# Altium project BMS_V2.1_Adv.PrjPcb (part 3 of 3)

## Sheet Power Section.SchDoc
size A3; SheetNumber: 6; SheetTotal: 12
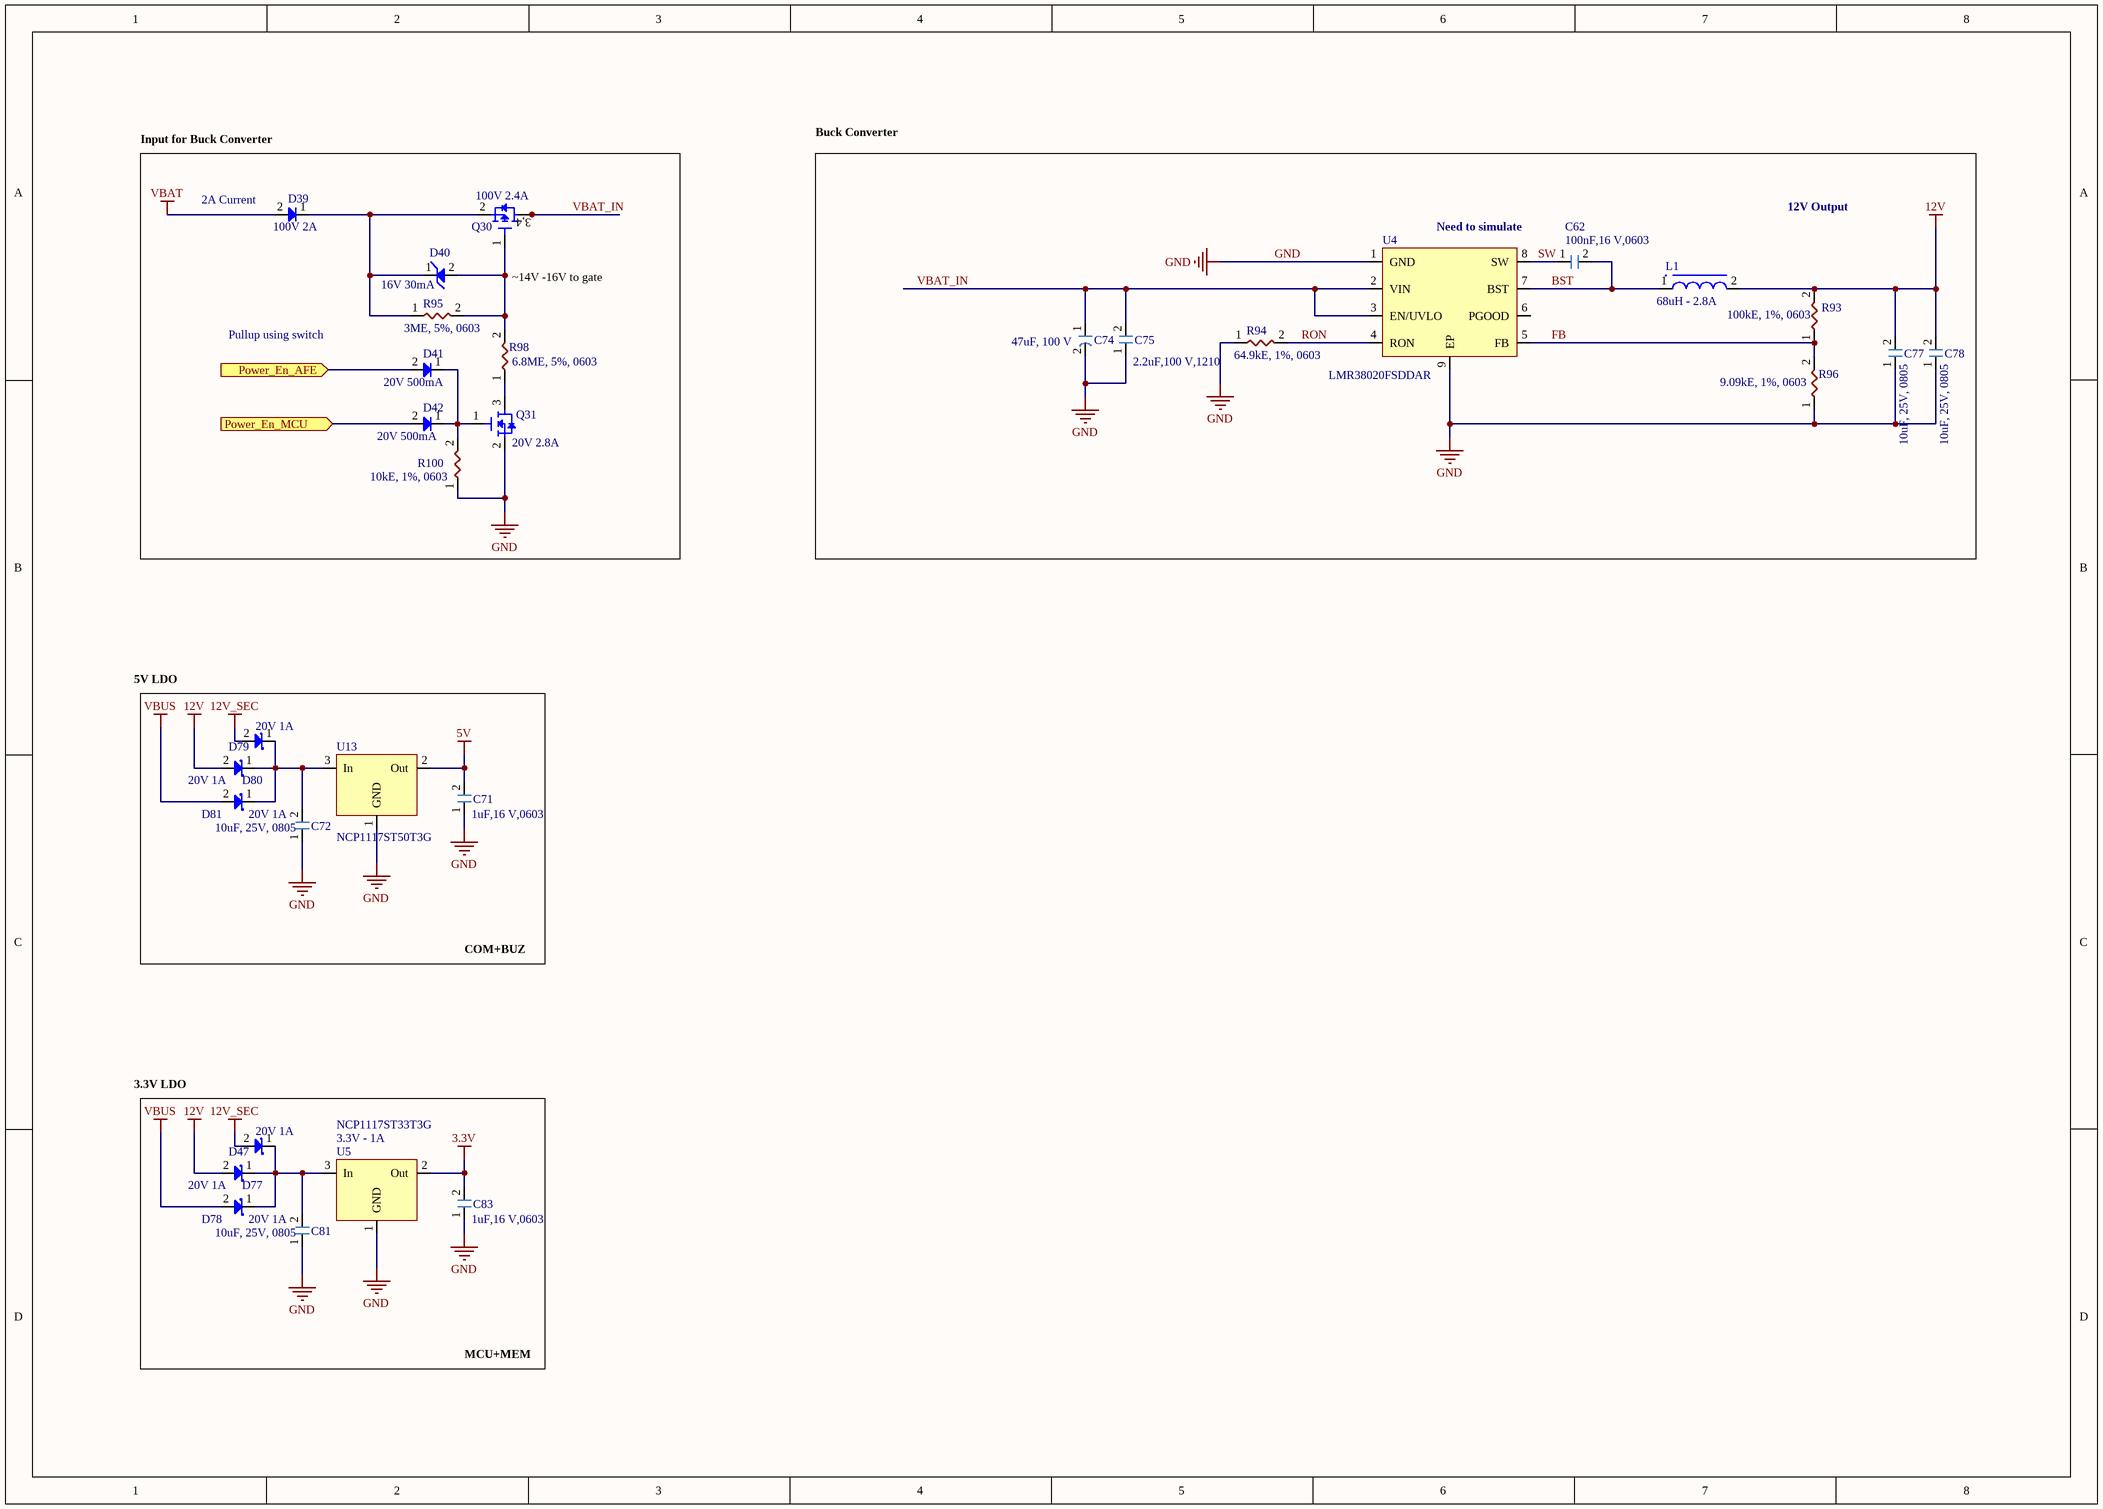
[diagram p7: Power Section.SchDoc]

### Parts
C62  Value Display: 100nF,16 V,0603  [CAPC1608X05N 0603]  (hidden comment: CC0603KRX7R7BB104)
C71  Value Display: 1uF,16 V,0603  [CAPC1608X05N 0603]  (hidden comment: CGA3E1X7R1C105K080AC)
C72  Value Display: 10uF, 25V, 0805  [CAPC2012X13N 0805]  (hidden comment: GRM21BZ71E106KE15L)
C74  Value Display: 47uF, 100 V  [Aluminium Electrolytic Capacitor]  (hidden comment: ESW476M100AH2AA)
C75  Value Display: 2.2uF,100 V,1210  [CAPC3225X28N 1210]  (hidden comment: HMK325B7225KMHT)
C77  Value Display: 10uF, 25V, 0805  [CAPC2012X13N 0805]  (hidden comment: GRM21BZ71E106KE15L)
C78  Value Display: 10uF, 25V, 0805  [CAPC2012X13N 0805]  (hidden comment: GRM21BZ71E106KE15L)
C81  Value Display: 10uF, 25V, 0805  [CAPC2012X13N 0805]  (hidden comment: GRM21BZ71E106KE15L)
C83  Value Display: 1uF,16 V,0603  [CAPC1608X05N 0603]  (hidden comment: CGA3E1X7R1C105K080AC)
D39  Value Display: 100V 2A  [SODFL350X110-2N]  (hidden comment: STPS2H100ZFY)
D40  Value Display: 16V 30mA  [DIODE_SOD123]  (hidden comment: MMSZ5246BQ-7-F)
D41  Value Display: 20V 500mA  [DIODE_SOD123]  (hidden comment: SBR80520LT1G)
D42  Value Display: 20V 500mA  [DIODE_SOD123]  (hidden comment: SBR80520LT1G)
D47  Value Display: 20V 1A  [SODFL360X98-2N]  (hidden comment: MBR120LSFT3G)
D77  Value Display: 20V 1A  [SODFL360X98-2N]  (hidden comment: MBR120LSFT3G)
D78  Value Display: 20V 1A  [SODFL360X98-2N]  (hidden comment: MBR120LSFT3G)
D79  Value Display: 20V 1A  [SODFL360X98-2N]  (hidden comment: MBR120LSFT3G)
D80  Value Display: 20V 1A  [SODFL360X98-2N]  (hidden comment: MBR120LSFT3G)
D81  Value Display: 20V 1A  [SODFL360X98-2N]  (hidden comment: MBR120LSFT3G)
L1  Value Display: 68uH - 2.8A  [INDP120120X102N]  (hidden comment: MSS1210-683ME)
Q30  Value Display: 100V 2.4A  [SOT230P700X180-4N]  (hidden comment: ZXMP10A17GQTA)
Q31  Value Display: 20V 2.8A  [SOT95P255X140-3N]  (hidden comment: DMG2302UK-7)
R93  Value Display: 100kE, 1%, 0603  [RESC1608X05N 0603]  (hidden comment: CRCW0805100KFKEA)
R94  Value Display: 64.9kE, 1%, 0603  [RESC1608X05N 0603]  (hidden comment: AC0603FR-0764K9L)
R95  Value Display: 3ME, 5%, 0603  [RESC1608X05N 0603]  (hidden comment: CRCW06033M00JNEA)
R96  Value Display: 9.09kE, 1%, 0603  [RESC1608X05N 0603]  (hidden comment: AC0603FR-079K09L)
R98  Value Display: 6.8ME, 5%, 0603  [RESC1608X05N 0603]  (hidden comment: CRCW06036M80JNEA)
R100  Value Display: 10kE, 1%, 0603  [RESC1608X05N 0603]  (hidden comment: CRCW060310K0FKEA)
U4  LMR38020FSDDAR  [SOIC127P600X170_HS-9N LM5164]
U5  NCP1117ST33T3G  Value Display: 3.3V - 1A  [SOT230P700X180-4N - NCP]
U13  NCP1117ST50T3G  [SOT230P700X180-4N - NCP]

### Blocks framed on the sheet
COM+BUZ: C71 C72 D79-D81 U13
MCU+MEM: C81 C83 D47 D77 D78 U5

### Ports
Power_En_AFE (in), Power_En_MCU (in)

### Nets
3.3V: C83.2 U5.2(Out)
5V: C71.2 U13.2(Out)
12V: C77.2 C78.2 D77.2(Anode) D80.2(Anode) L1.2 R93.2
12V_SEC: D47.2(Anode) D79.2(Anode)
GND: C71.1 C72.1 C74.2 C75.1 C77.1 C78.1 C81.1 C83.1 Q31.2(Source) R94.1 R96.1 R100.1 U4.1(GND) U4.9(EP) U5.1(GND) U13.1(GND)
VBAT: D39.2(Anode)
VBUS: D78.2(Anode) D81.2(Anode)
BST: C62.2 L1.1 U4.7(BST)
FB: R93.1 R96.2 U4.5(FB)
Power_En_AFE: D41.2(Anode) ; port Power_En_AFE
Power_En_MCU: D42.2(Anode) ; port Power_En_MCU
RON: R94.2 U4.4(RON)
SW: C62.1 U4.8(SW)
VBAT_IN: C74.1 C75.2 Q30.3(Drain) Q30.4(Drain) U4.2(VIN) U4.3(EN/UVLO)
NetC72_2: C72.2 D79.1(Cathode) D80.1(Cathode) D81.1(Cathode) U13.3(In)
NetC81_2: C81.2 D47.1(Cathode) D77.1(Cathode) D78.1(Cathode) U5.3(In)
NetD39_1: D39.1(Cathode) D40.1(Cathode) Q30.2(Source) R95.1
NetD40_2: D40.2(Anode) Q30.1(Gate) R95.2 R98.2
NetD41_1: D41.1(Cathode) D42.1(Cathode) Q31.1(Gate) R100.2
NetQ31_3: Q31.3(Drain) R98.1

Not connected (* = marked no-connect by the designer): U4 6(PGOOD)

### Notes on the sheet
- Input for Buck Converter
- Buck Converter
- (near D39) 2A Current
- (near U4) Need to simulate
- 12V Output
- (near Q30) ~14V -16V to gate
- Pullup using switch
- 5V LDO
- 3.3V LDO
- (in symbol FET_ZXMP10A17GQTA) 3,4

### Library data of the parts
C62 = Cap_CC0603KRX7R7BB104: Multilayer Ceramic Capacitor, 100 nF, 16V, ±10%,  X7R 0603 [1608 Metric]; Manufacturer: Yageo; Value: 100nF; Max Temp: 125 degC; Min Temp: -55 degC; Polarized: No; AEC-Q: NA; Manufacturer Part Number: CC0603KRX7R7BB104; Category: Capacitor; ComponentLink1Description: Datasheet; Mount Type: Surface Mount; Package: 0603; RoHS: Yes; Supplier 1: Digikey; Supplier 1 Part Number: 311-1088-1-ND; Supplier 1 pricing per Unit: 8.34 INR; Supplier: Mouser; Supplier Part Number: 603-CC603KRX7R7BB104; Supplier pricing per Unit: 8.34 INR; Technology: Ceramic; Temp Coefficient: X7R; Tolerance: 10%; Value 1: CC0603KRX7R7BB104; Voltage: 16V; ComponentLink1URL: https://www.yageo.com/upload/media/product/productsearch/datasheet/mlcc/UPY-GPHC_X7R_6.3V-to-250V_24.pdf
C71 C83 = Cap_CGA3E1X7R1C105K080AC: Multilayer Ceramic Capacitor, 1uF, 16V, ±10%,  X7R 0603 [1608 Metric]; Manufacturer: TDK Corporation; Polarized: No; AEC-Q: 200; Min Temp: -55 degC; Max Temp: 125 degC; Value: 1 uF; Manufacturer Part Number: CGA3E1X7R1C105K080AC; Package: 0603; RoHS: Yes; Mount Type: Surface Mount; Supplier 1: Digikey; Voltage: 16V; Tolerance: 10%; Technology: Ceramic; Value 1: CGA3E1X7R1C105K080AC; Category: Capacitor; ComponentLink1Description: Datasheet; ComponentLink1URL: https://product.tdk.com/system/files/dam/doc/product/capacitor/ceramic/mlcc/catalog/mlcc_automotive_general_en.pdf; Supplier 1 Part Number: 445-12539-1-ND; Supplier 1 pricing per Unit: 10.84 INR; Supplier: Mouser; Supplier Part Number: 810-CGA3E1X7R1C105AC; Supplier pricing per Unit: 10.01 INR; Temp Coefficient: X7R
C72 C77 C78 C81 = Cap_GRM21BZ71E106KE15L: Multilayer Ceramic Capacitor, 10 uF, 25V, ±10%,  X7R 0805 (2012 Metric); Manufacturer: Murata; AEC-Q: NA; Max Temp: 125 degC; Min Temp: -55 degC; Polarized: No; Value: 10 uF; Category: Capacitor; ComponentLink1Description: Datasheet; ComponentLink1URL: https://search.murata.co.jp/Ceramy/image/img/A01X/G101/ENG/GRM21BZ71E106KE15-01.pdf; Manufacturer Part Number: GRM21BZ71E106KE15L; Mount Type: Surface Mount; Package: 0805; RoHS: Yes; Supplier 1: Digikey; Supplier 1 Part Number: 490-GRM21BZ71E106KE15LCT-ND; Supplier 1 pricing per Unit: 28.51 INR; Supplier: Mouser; Supplier Part Number: 81-GRM21BZ71E106KE5L; Supplier pricing per Unit: 30.02 INR; Technology: Ceramic; Temp Coefficient: X7R; Tolerance: 10%; Value 1: GRM21BZ71E106KE15L; Voltage: 25V
C74 = Cap_ESW476M100AH2AA: Aluminum Electrolytic Capacitors Radial, 47 µF 100 V, Can 370mOhm @ 100kHz 5000 Hrs @ 105°C; Manufacturer: KEMET; AEC-Q: NA; Max Temp: 105 degC; Min Temp: -40 degC; Pitch: 5 mm; Polarized: Yes; Temp Coefficient: Electrolyte; Tolerance: 20%; Value: 47uF; Voltage: 100V; Manufacturer Part Number: ESW476M100AH2AA; Category: Capacitor; ComponentLink1Description: Datasheet; ComponentLink1URL: https://www.mouser.in/datasheet/2/447/KEM_A4009_ESW-3316312.pdf; Mount Type: TH; Package: TH; RoHS: Yes; Supplier 1: Digikey; Supplier 1 Part Number: 399-6631-ND; Supplier 1 pricing per Unit: 35.85 INR; Supplier: Mouser; Supplier Part Number: 80-ESW476M100AH2AA; Supplier pricing per Unit: 35.86 INR; Technology: Electrolyte; Value 1: ESW476M100AH2AA
C75 = Cap_HMK325B7225KMHT: Multilayer Ceramic Capacitor, 2.2 uF, 100 V, ± 10%, X7R, 1210 [3225 Metric]; Manufacturer: Taiyo Yuden; AEC-Q: 200; Max Temp: 125 degC; Min Temp: -55 degC; Polarized: No; Value: 2.2uF; Voltage: 100V; Manufacturer Part Number: HMK325B7225KMHT; Category: Capacitor; ComponentLink1Description: Datasheet; ComponentLink1URL: https://ds.yuden.co.jp/TYCOMPAS/ut/detail?pn=HMK325B7225KMHT%20%20&u=M; Mount Type: Surface Mount; Package: 1210; RoHS: Yes; Supplier 1: Digikey; Supplier 1 Part Number: 587-6142-1-ND; Supplier 1 pricing per Unit: 33.35 INR; Supplier: Mouser; Supplier Part Number: 963-HMK325B7225KMHT; Supplier pricing per Unit: 32.53 INR; Technology: Ceramic; Temp Coefficient: X7R; Tolerance: 10%; Value 1: HMK325B7225KMHT
D39 = Diode_STPS2H100ZFY: Diode 100 V 2A Surface Mount SOD-123F; Manufacturer: ST; AEC-Q: 101; Forward Voltage: 0.7V @ 2A; Max Temp: 175 degC; Min Temp: -40 degC; Value: 100V 2A; Voltage: 100V; Category: Diode; ComponentLink1Description: Datasheet; ComponentLink1URL: https://www.st.com/content/ccc/resource/technical/document/datasheet/group3/ee/fd/cc/9a/a8/bc/46/dd/DM00306086/files/DM00306086.pdf/jcr:content/translations/en.DM00306086.pdf; Forward Current: 2A; Manufacturer Part Number: STPS2H100ZFY; Mount Type: Surface Mount; Package: SOD 123; RoHS: Yes; Supplier 1: Digikey; Supplier 1 Part Number: 497-17158-1-ND; Supplier 1 pricing per Unit: 36.72 INR; Supplier: Mouser; Supplier Part Number: 511-STPS2H100ZFY; Supplier pricing per Unit: 36.70 INR; Value 1: STPS2H100ZFY
D40 = Diode_MMSZ5246BQ-7-F: Zener Diode 16 V 500 mW ±5% Surface Mount SOD-123; Manufacturer: Diodes Inc.; AEC-Q: 101; Forward Current: 30mA; Forward Voltage: 900 mV @ 10 mA; Max Temp: 150 degC; Min Temp: -65 degC; Power: 370mW; Value: 16V 30mA; Voltage: 16V; Category: Diode; ComponentLink1Description: Datasheet; ComponentLink1URL: https://www.diodes.com/assets/Datasheets/ds18010.pdf; Manufacturer Part Number: MMSZ5246BQ-7-F; Mount Type: Surface Mount; Package: SOD 123; RoHS: Yes; Supplier 1: Digikey; Supplier 1 Part Number: 31-MMSZ5246BQ-7-FTR-ND; Supplier: Mouser; Value 1: MMSZ5246BQ-7-F; Supplier 1 pricing per Unit: 17.9 INR; Supplier Part Number: 621-MMSZ5246BQ-7-F; Supplier pricing per Unit: 17.71 INR
D41 D42 = Diode_SBR80520LT1G: Diode 20 V 500mA Surface Mount SOD-123; Manufacturer: OnSemi; AEC-Q: NA; Forward Voltage: 385 mV @ 500 mA; Max Temp: 125 degC; Min Temp: -65 degC; Voltage: 20V; Category: Diode; ComponentLink1Description: Datasheet; ComponentLink1URL: https://www.onsemi.com/pdf/datasheet/mbr0520lt1-d.pdf; Forward Current: 500mA; Manufacturer Part Number: SBR80520LT1G; Mount Type: Surface Mount; Package: SOD 123; RoHS: Yes; Supplier 1: Digikey; Supplier 1 Part Number: SBR80520LT1GOSCT-ND; Supplier 1 pricing per Unit: 34.22 INR; Supplier: Mouser; Supplier Part Number: 863-SBR80520LT1G; Supplier pricing per Unit: 34.19 INR; Value 1: SBR80520LT1G; Value: 20V 500mA
D47 D77-D81 = Diode_MBR120LSFT3G: DIODE SCHOTTKY 20V 1A SOD123FL; Manufacturer: OnSemi; AEC-Q: NA; Forward Voltage: 450mV @ 1A; Max Temp: 125 degC; Min Temp: -55 degC; Value: 20V 1A; Category: Diode; ComponentLink1Description: Datasheet; ComponentLink1URL: https://www.onsemi.com/pdf/datasheet/mbr120lsft1-d.pdf; Forward Current: 1A; Manufacturer Part Number: MBR120LSFT3G; Mount Type: Surface Mount; Package: SOD 123; RoHS: Yes; Supplier 1: Digikey; Supplier 1 Part Number: MBR120LSFT3GOSCT-ND; Supplier 1 pricing per Unit: 27.69 INR; Supplier: Mouser; Supplier Part Number: 863-MBR120LSFT3G; Supplier pricing per Unit: 38.36 INR; Value 1: MBR120LSFT3G; Voltage: 20V
L1 = Ind_MSS1210-683ME: 68 µH Shielded Drum Core, Wirewound Inductor 2.8 A 80mOhm Max Nonstandard; Manufacturer: Coilcraft; Manufacturer Part Number: MSS1210-683MED; AEC-Q: 200; Max Temp: 85 degC; Min Temp: -40 degC; Value: 68uH - 2.8A; Category: Inductor; ComponentLink1Description: Datasheet; ComponentLink1URL: https://www.coilcraft.com/getmedia/f1a1bc5f-bdff-42f8-9ca8-1a0fb1d5094f/MSS1210.pdf; Mount Type: Surface Mount; Package: SMT; RoHS: Yes; Supplier 1: Digikey; Supplier 1 Part Number: 2457-MSS1210-683MED-ND; Supplier 1 pricing per Unit: 334.68 INR; Supplier: Mouser; Supplier Part Number: 994-MSS1210-683MED; Supplier pricing per Unit: 338.36 INR; Value 1: MSS1210-683MED
Q30 = FET_ZXMP10A17GQTA: P-Channel 100 V 2.4A (Ta) 2W (Ta) Surface Mount SOT-223-3; Manufacturer: Diodes Inc.; AEC-Q: 101; Forward Voltage: 100V; Max Temp: 150 degC; Min Temp: -55 degC; Rds ON: 350mΩ @ 2.4A @ -10V; Category: MOSFET; ComponentLink1Description: Datasheet; ComponentLink1URL: https://www.diodes.com/assets/Datasheets/ZXMP10A17GQ.pdf; Forward Current: 2.4A; Manufacturer Part Number: ZXMP10A17GQTA; Mount Type: Surface Mount; Package: SOT 23-3; Power: 2W; RoHS: Yes; Supplier 1: Digikey; Supplier 1 Part Number: ZXMP10A17GQTADICT-ND; Supplier 1 pricing per Unit: 85.13 INR; Supplier: Mouser; Supplier Part Number: 621-ZXMP10A17GQTA; Supplier pricing per Unit: 85.07 INR; Value 1: ZXMP10A17GQTA; Value: 100V 2.4A; Voltage: 100V; Channel: P-Channel
Q31 = FET_DMG2302UK-7: N-Channel 20 V 2.8A (Ta) 660mW (Ta) Surface Mount SOT-23-3; Manufacturer: Diodes Inc.; AEC-Q: 101; Forward Voltage: 20V; Max Temp: 150 degC; Min Temp: -55 degC; Rds ON: 90mOhms @ 3.6A, 4.5V; Manufacturer Part Number: DMG2302UK-7; Value: 20V 2.8A; RoHS: Yes; Category: MOSFET; ComponentLink1Description: Datasheet; ComponentLink1URL: https://www.diodes.com/assets/Datasheets/DMG2302UK.pdf; Forward Current: 2.8A; Mount Type: Surface Mount; Package: SOT 23-3; Power: 660mW; Supplier 1: Digikey; Supplier 1 Part Number: DMG2302UK-7DICT-ND; Supplier 1 pricing per Unit: 28.35 INR; Supplier: Mouser; Supplier Part Number: 621-DMG2302UK-7; Supplier pricing per Unit: 22.52 INR; Value 1: DMG2302UK-7; Voltage: 20V; Channel: N-Channel
R93 = Res_CRCW0603100KFKEA: SMD Chip Resistor, 100k Ohm, ± 1%, 100 mW, 0603 [1608 Metric], Thick Film, General Purpose; Manufacturer: Vishay Dale; AEC-Q: 200; Max Temp: 155 degC; Min Temp: -55 degC; Power: 1/10W; Value: 100k R; Manufacturer Part Number: CRCW0603100KFKEA; Category: Resistor; ComponentLink1Description: Datasheet; ComponentLink1URL: https://www.vishay.com/docs/20035/dcrcwe3.pdf; Mount Type: Surface Mount; Package: 0603; RoHS: Yes; Supplier 1: Digikey; Supplier 1 Part Number: 541-100KCCT-ND; Supplier 1 pricing per Unit: 8.34 INR; Supplier: Mouser; Supplier Part Number: 71-CRCW0603-100K-E3; Supplier pricing per Unit: 8.34 INR; Tolerance: 1%; Value 1: CRCW0603100KFKEA
R94 = Res_AC0603FR-0764K9L: SMD Chip Resistor,64.9k Ohms ±1% 0.1W, 1/10W, 0603 (1608 Metric) Anti-Sulfur, Automotive AEC-Q200 Thick Film; Manufacturer: Yageo; AEC-Q: 200; Max Temp: 155 degC; Min Temp: -55 degC; Value: 64.9k R; Category: Resistor; ComponentLink1Description: Datasheet; ComponentLink1URL: https://www.yageo.com/upload/media/product/productsearch/datasheet/rchip/PYu-AC_51_RoHS_L_10.pdf; Manufacturer Part Number: AC0603FR-0764K9L; Mount Type: Surface Mount; Package: 0603; Power: 1/10W; RoHS: Yes; Supplier 1: Digikey; Supplier 1 Part Number: 13-AC0603FR-0764K9LCT-ND; Supplier 1 pricing per Unit: 8.34 INR; Supplier: Mouser; Supplier Part Number: 603-AC0603FR-0764K9L; Supplier pricing per Unit: 8.34 INR; Tolerance: 1%; Value 1: AC0603FR-0764K9L
R95 = Res_CRCW06033M00JNEA: SMD Chip Resistor,3 MOhms ±5%, 1/10W, 0603 (1608 Metric) Anti-Sulfur, Automotive AEC-Q200 Thick Film; Manufacturer: Vishay Dale; AEC-Q: 200; Max Temp: 155 degC; Min Temp: -55 degC; Value: 3M R; Category: Resistor; ComponentLink1Description: Datasheet; ComponentLink1URL: https://www.vishay.com/docs/20035/dcrcwe3.pdf; Manufacturer Part Number: CRCW06033M00JNEA; Mount Type: Surface Mount; Package: 0603; Power: 1/10W; RoHS: Yes; Supplier 1: Digikey; Supplier 1 Part Number: 541-CRCW06033M00JNEACT-ND; Supplier 1 pricing per Unit: 8.34 INR; Supplier: Mouser; Supplier Part Number: 71-CRCW0603J-3M-E3; Supplier pricing per Unit: 8.34 INR; Tolerance: 5%; Value 1: CRCW06033M00JNEA
R96 = Res_AC0603FR-079K09L: SMD Chip Resistor,9.09k Ohms ±1% 0.1W, 1/10W, 0603 (1608 Metric) Anti-Sulfur, Automotive AEC-Q200 Thick Film; Manufacturer: Yageo; AEC-Q: 200; Max Temp: 155 degC; Min Temp: -55 degC; Value: 9.09k R; Category: Resistor; ComponentLink1Description: Datasheet; ComponentLink1URL: https://www.yageo.com/upload/media/product/productsearch/datasheet/rchip/PYu-AC_51_RoHS_L_10.pdf; Manufacturer Part Number: AC0603FR-079K09L; Mount Type: Surface Mount; Package: 0603; Power: 1/10W; RoHS: Yes; Supplier 1: Digikey; Supplier 1 Part Number: 13-AC0603FR-079K09LCT-ND; Supplier 1 pricing per Unit: 8.34 INR; Supplier: Mouser; Supplier Part Number: 603-AC0603FR-079K09L; Supplier pricing per Unit: 8.34 INR; Tolerance: 1%; Value 1: AC0603FR-079K09L
R98 = Res_CRCW06036M80JNEA: SMD Chip Resistor,6.8 MOhms ±5%, 1/10W, 0603 (1608 Metric) Anti-Sulfur, Automotive AEC-Q200 Thick Film; Manufacturer: Vishay Dale; AEC-Q: 200; Max Temp: 155 degC; Min Temp: -55 degC; Value: 6.8M R; Category: Resistor; ComponentLink1Description: Datasheet; ComponentLink1URL: https://www.vishay.com/docs/20035/dcrcwe3.pdf; Manufacturer Part Number: CRCW06036M80JNEA; Mount Type: Surface Mount; Package: 0603; Power: 1/10W; RoHS: Yes; Supplier 1: Digikey; Supplier 1 Part Number: 541-CRCW06036M80JNEACT-ND; Supplier 1 pricing per Unit: 8.34 INR; Supplier: Mouser; Supplier Part Number: 71-CRCW0603J-6.8M-E3; Supplier pricing per Unit: 8.34 INR; Tolerance: 5%; Value 1: CRCW06036M80JNEA
R100 = Res_CRCW060310K0FKEA: SMD Chip Resistor, 10 kOhm,±1%, 100 mW, 0603 [1608 Metric], Thick Film, General Purpose; Manufacturer: Vishay Dale; AEC-Q: 200; Max Temp: 155 degC; Min Temp: -55 degC; Power: 1/10W; Value: 10k R; Category: Resistor; ComponentLink1Description: Datasheet; ComponentLink1URL: https://www.vishay.com/docs/20035/dcrcwe3.pdf; Manufacturer Part Number: CRCW060310K0FKEA; Mount Type: Surface Mount; Package: 0603; RoHS: Yes; Supplier 1: Digikey; Supplier 1 Part Number: 541-10.0KHCT-ND; Supplier 1 pricing per Unit: 8.34 INR; Supplier: Mouser; Supplier Part Number: 71-CRCW0603-10K-E3; Supplier pricing per Unit: 8.34 INR; Tolerance: 1%; Value 1: CRCW060310K0FKEA
U4 = IC_LMR38020FSDDAR: Buck Switching Regulator IC Positive Adjustable 1V 1 Output 2A 8-PowerSOIC (0.154", 3.90mm Width); Manufacturer: Texas Instruments; AEC-Q: NA; Max Temp: 150 degC; Min Temp: -40 degC; Voltage: 4.5V - 80V; Category: Buck Converter IC; ComponentLink1Description: Datasheet; ComponentLink1URL: https://www.ti.com/lit/ds/symlink/lmr38020.pdf?ts=1730698175380&ref_url=https%253A%252F%252Fwww.ti.com%252Fproduct%252FLMR38020%253FkeyMatch%253DLMR38020%2526tisearch%253Duniversal_search; Manufacturer Part Number: LMR38020FSDDAR; Mount Type: Surface Mount; Package: DDA (SO Power PAD); RoHS: Yes; Supplier 1: Digikey; Supplier 1 Part Number: 296-LMR38020FSDDARCT-ND; Supplier 1 pricing per Unit: 207.70 INR; Supplier: Mouser; Supplier Part Number: 595-LMR38020FSDDAR; Supplier pricing per Unit: 206.00 INR; Value 1: LMR38020FSDDAR; Value: LMR38020FSDDAR; Value Display: LMR38020FSDDAR
U5 = IC_NCP1117ST33T3G: LDO Voltage Regulators 3.3V 1A Positive; Manufacturer: OnSemi; AEC-Q: NA; Max Temp: 125 degC; Min Temp: 0 degC; Value: 3.3V - 1A; Voltage: 20V (Max); Category: LDO; ComponentLink1Description: Datasheet; ComponentLink1URL: https://www.onsemi.com/pdf/datasheet/ncp1117-d.pdf; Manufacturer Part Number: NCP1117ST33T3G; Mount Type: Surface Mount; Package: SOT 22-3; RoHS: Yes; Supplier 1: Digikey; Supplier 1 Part Number: NCP1117ST33T3GOSCT-ND; Supplier 1 pricing per Unit: 93.9 INR; Supplier: Mouser; Supplier Part Number: 863-NCP1117ST33T3G; Supplier pricing per Unit: 56.71 INR; Value 1: NCP1117ST33T3G
U13 = IC_NCP1117ST50T3G: LDO Voltage Regulators 5V 1A Positive; Manufacturer: OnSemi; AEC-Q: NA; Max Temp: 125 degC; Min Temp: 0 degC; Value: 5V - 1A; Voltage: 20V (Max); Category: LDO; ComponentLink1Description: Datasheet; ComponentLink1URL: https://www.onsemi.com/pdf/datasheet/ncp1117-d.pdf; Manufacturer Part Number: NCP1117ST50T3G; Mount Type: Surface Mount; Package: SOT 22-3; RoHS: Yes; Supplier 1: Digikey; Supplier 1 Part Number: NCP1117ST50T3GOSCT-ND; Supplier 1 pricing per Unit: 94.18 INR; Supplier: Mouser; Supplier Part Number: 863-NCP1117ST50T3G; Supplier pricing per Unit: 56.71 INR; Value 1: NCP1117ST50T3G; Value Display: 5V - 1A

## Sheet Accelerometer.SchDoc
size A3; SheetNumber: 10; SheetTotal: 12
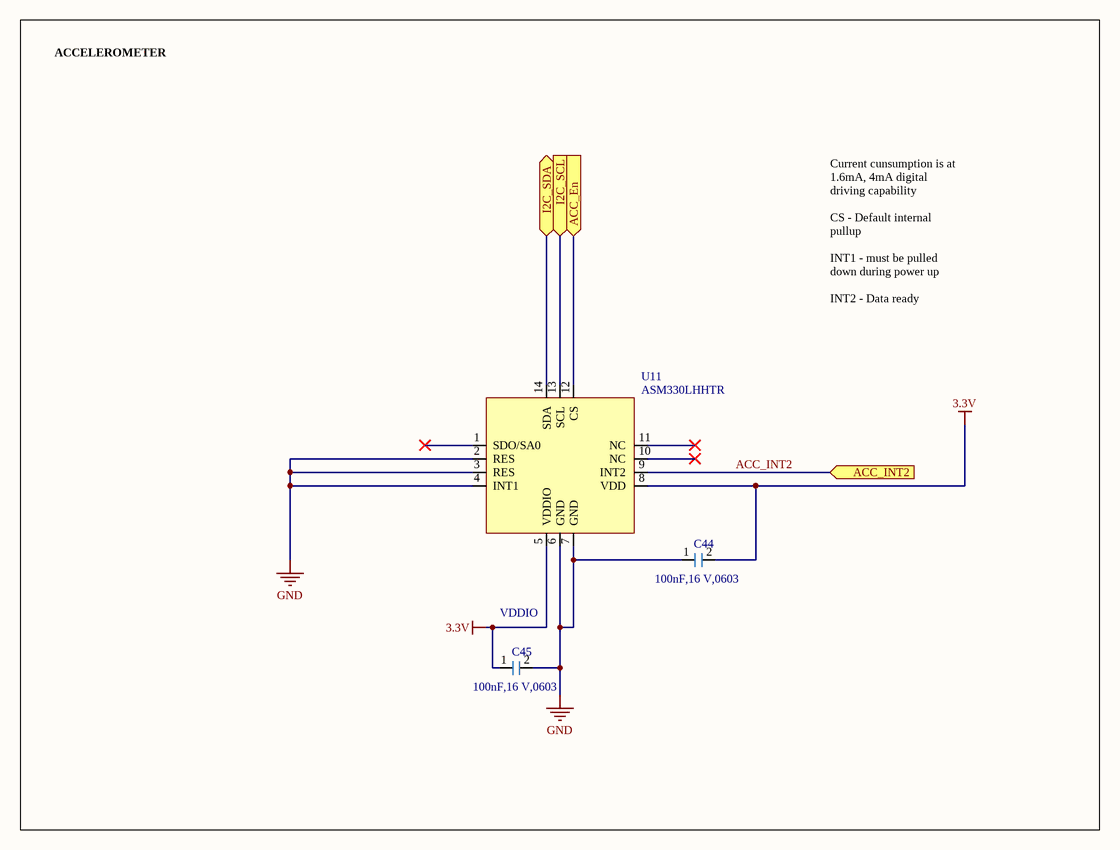
[diagram p8: Accelerometer.SchDoc]

### Parts
C44  Value Display: 100nF,16 V,0603  [CAPC1608X05N 0603]  (hidden comment: CC0603KRX7R7BB104)
C45  Value Display: 100nF,16 V,0603  [CAPC1608X05N 0603]  (hidden comment: CC0603KRX7R7BB104)
U11  ASM330LHHTR  [QFN50P300X250X86-14N_ASM330LHHTR]

### Ports
ACC_En (in), ACC_INT2 (in), I2C_SCL (in), I2C_SDA (bidir)

### Nets
3.3V: C44.2 C45.1 U11.5(VDDIO) U11.8(VDD)
GND: C44.1 C45.2 U11.2(RES) U11.3(RES) U11.4(INT1) U11.6(GND) U11.7(GND)
ACC_INT2: U11.9(INT2) ; port ACC_INT2
I2C_EN: U11.12(CS) ; port ACC_En
I2C_SCL: U11.13(SCL) ; port I2C_SCL
I2C_SDA: U11.14(SDA) ; port I2C_SDA

Not connected (* = marked no-connect by the designer): U11 1(SDO/SA0)* 10(NC)* 11(NC)*

### Notes on the sheet
- ACCELEROMETER
- Current cunsumption is at 1.6mA, 4mA digital driving capability
  CS - Default internal pullup
  INT1 - must be pulled down during power up
  INT2 - Data ready
- VDDIO

### Library data of the parts
C44 C45 = Cap_CC0603KRX7R7BB104: as C62 on sheet Power Section; Manufacturer Part Number: CC0603KRX7R7BB104; Category: Capacitor; ComponentLink1Description: Datasheet; Mount Type: Surface Mount; Package: 0603; RoHS: Yes; Supplier 1: Digikey; Supplier 1 Part Number: 311-1088-1-ND; Supplier 1 pricing per Unit: 8.34 INR; Supplier: Mouser; Supplier Part Number: 603-CC603KRX7R7BB104; Supplier pricing per Unit: 8.34 INR; Technology: Ceramic; Temp Coefficient: X7R; Tolerance: 10%; Value 1: CC0603KRX7R7BB104; Voltage: 16V; ComponentLink1URL: https://www.yageo.com/upload/media/product/productsearch/datasheet/mlcc/UPY-GPHC_X7R_6.3V-to-250V_24.pdf
U11 = IC_ASM330LHHTR: Accelerometer, Gyroscope, Temperature, 6 Axis Sensor I2C, SPI Output; Manufacturer: ST; AEC-Q: 100; Max Temp: 105 degC; Min Temp: -40 degC; Value: 6D IMU; Voltage: 3.3V; Category: Inertial module; ComponentLink1Description: Datasheet; ComponentLink1URL: https://www.st.com/resource/en/datasheet/asm330lhh.pdf; Manufacturer Part Number: ASM330LHHTR; Mount Type: Surface Mount; Package: SMT; RoHS: Yes; Supplier 1: Digikey; Supplier 1 Part Number: 497-19078-1-ND; Supplier 1 pricing per Unit: 850.9 INR; Supplier: Mouser; Supplier Part Number: 511-ASM330LHHTR; Supplier pricing per Unit: 810.11 INR; Value 1: ASM330LHHTR; Value Display: ASM330LHHTR

## Sheet Connections1.SchDoc
size A3; SheetNumber: 12; SheetTotal: 12
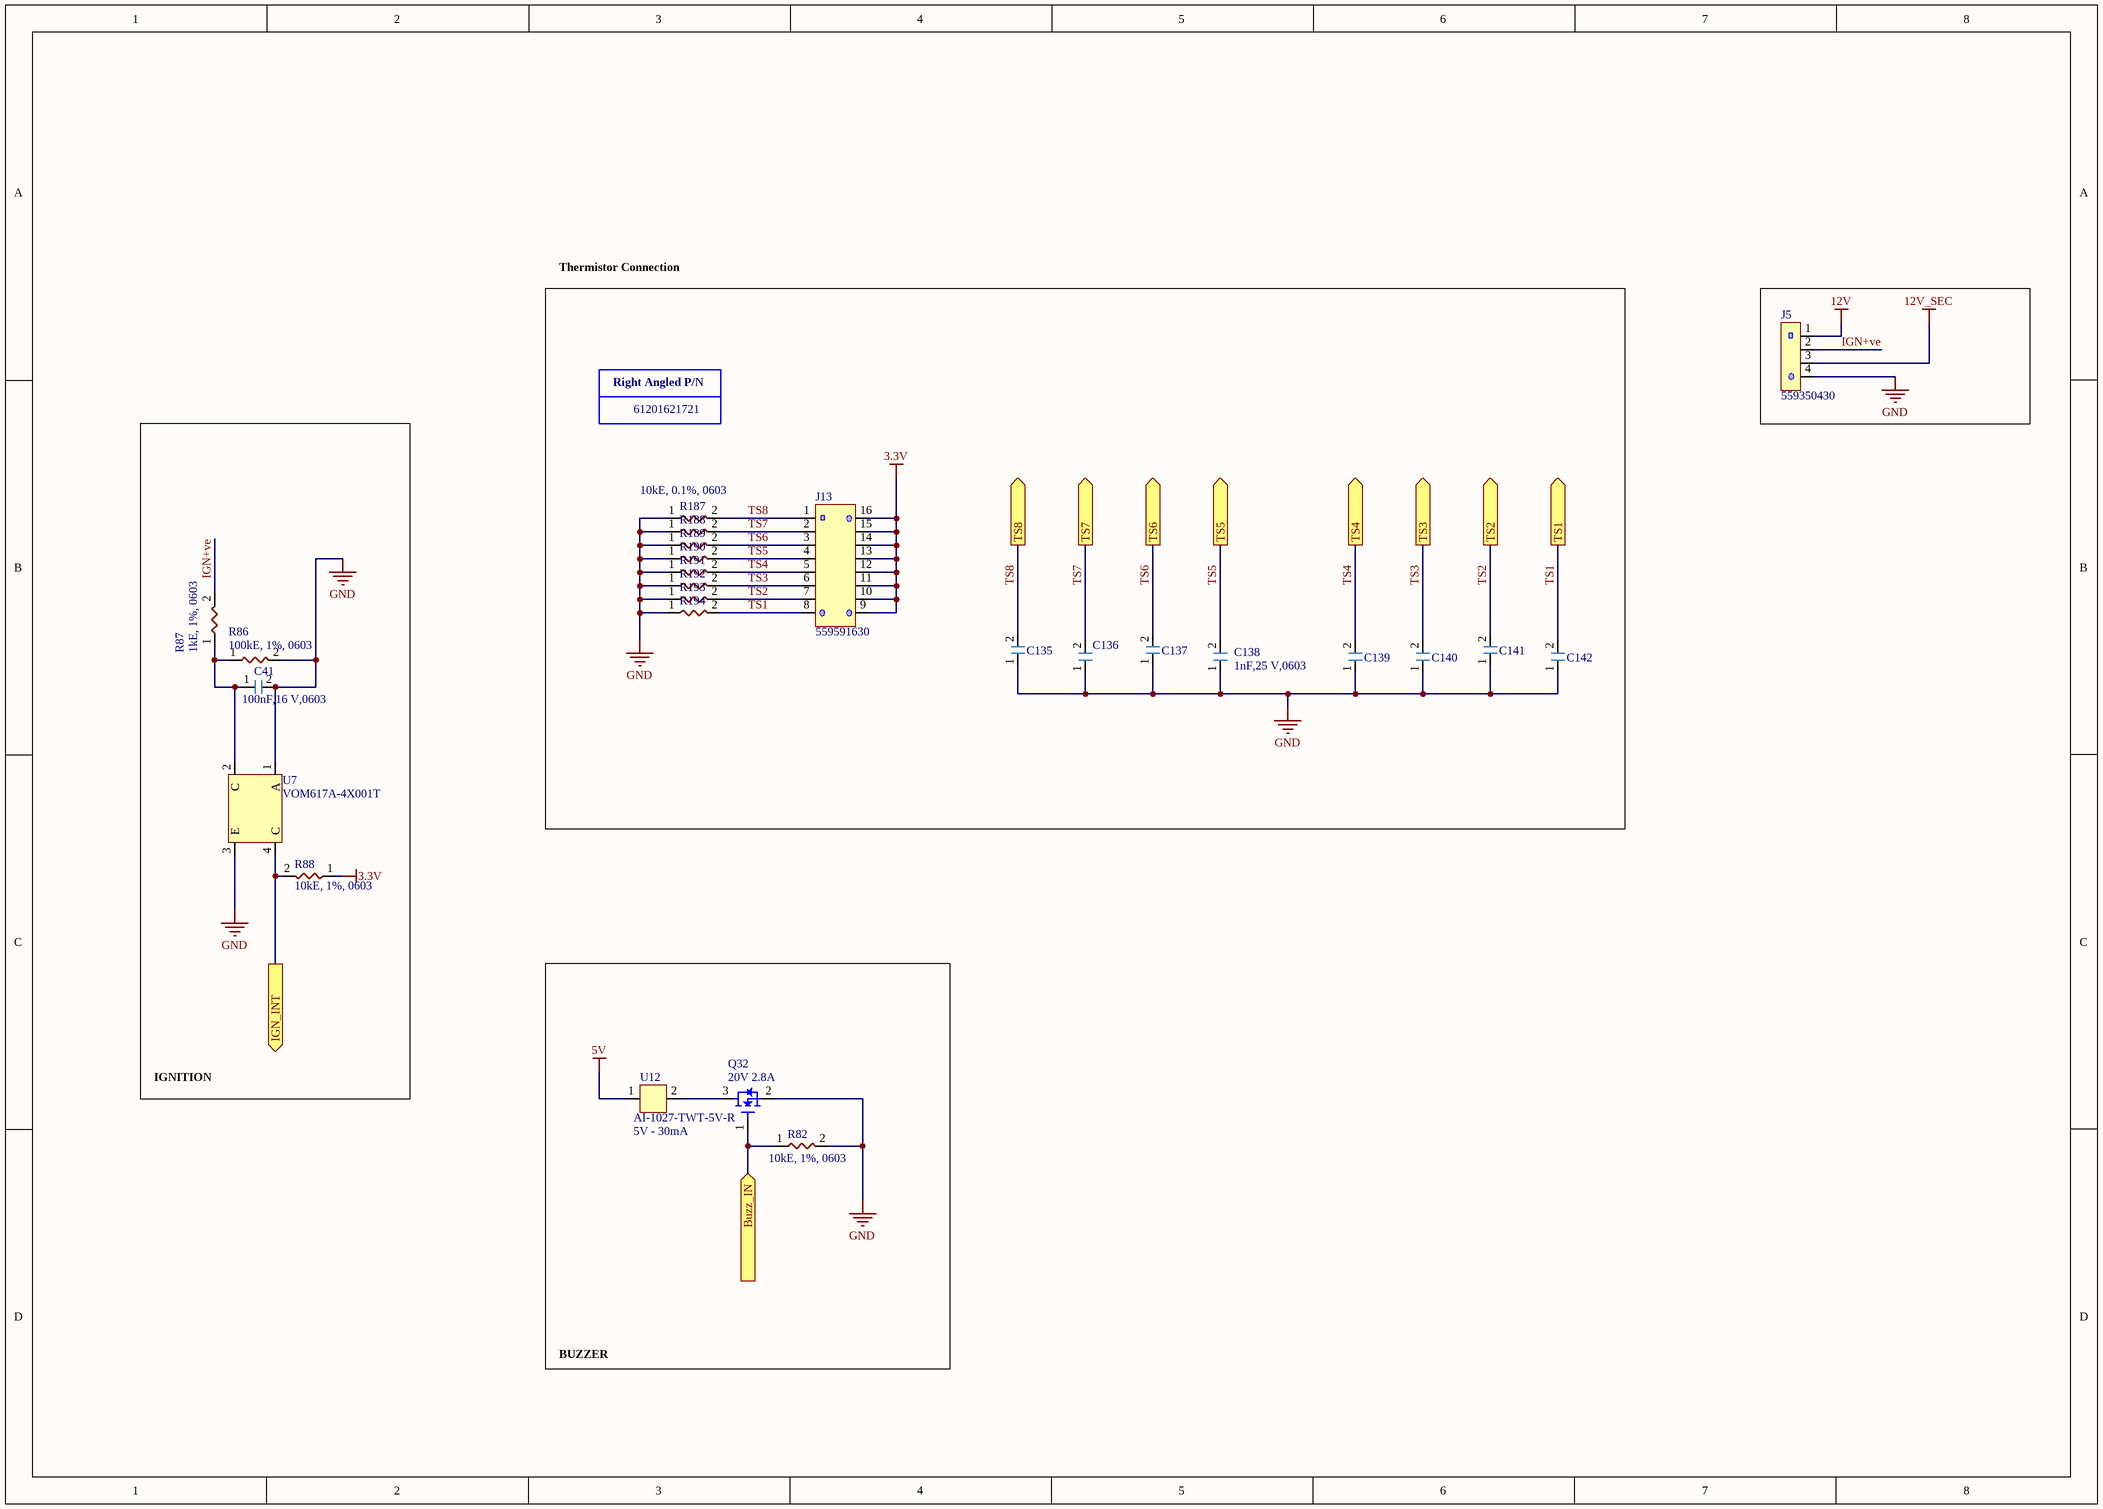
[diagram p9: Connections1.SchDoc]

### Parts
C41  Value Display: 100nF,16 V,0603  [CAPC1608X05N 0603]  (hidden comment: CC0603KRX7R7BB104)
C135  C0603C102J3GACAUTO  [CAPC1608X05N 0603]  (value not drawn)
C136  C0603C102J3GACAUTO  [CAPC1608X05N 0603]  (value not drawn)
C137  C0603C102J3GACAUTO  [CAPC1608X05N 0603]  (value not drawn)
C138  Value Display: 1nF,25 V,0603  [CAPC1608X05N 0603]  (hidden comment: C0603C102J3GACAUTO)
C139  C0603C102J3GACAUTO  [CAPC1608X05N 0603]  (value not drawn)
C140  C0603C102J3GACAUTO  [CAPC1608X05N 0603]  (value not drawn)
C141  C0603C102J3GACAUTO  [CAPC1608X05N 0603]  (value not drawn)
C142  C0603C102J3GACAUTO  [CAPC1608X05N 0603]  (value not drawn)
J5  559350430  [Con_559350430]
J13  559591630  [Con_0559591630]
Q32  Value Display: 20V 2.8A  [SOT95P255X140-3N]  (hidden comment: DMG2302UK-7)
R82  Value Display: 10kE, 1%, 0603  [RESC1608X05N 0603]  (hidden comment: CRCW060310K0FKEA)
R86  Value Display: 100kE, 1%, 0603  [RESC1608X05N 0603]  (hidden comment: CRCW0805100KFKEA)
R87  Value Display: 1kE, 1%, 0603  [RESC1608X05N 0603]  (hidden comment: AC0603FR-7W1KL)
R88  Value Display: 10kE, 1%, 0603  [RESC1608X05N 0603]  (hidden comment: CRCW060310K0FKEA)
R187  Value Display: 10kE, 0.1%, 0603  [RESC1608X05N 0603]  (hidden comment: RNCF0603BTE10K0)
R188  RNCF0603BTE10K0  [RESC1608X05N 0603]  (value not drawn)
R189  RNCF0603BTE10K0  [RESC1608X05N 0603]  (value not drawn)
R190  RNCF0603BTE10K0  [RESC1608X05N 0603]  (value not drawn)
R191  RNCF0603BTE10K0  [RESC1608X05N 0603]  (value not drawn)
R192  RNCF0603BTE10K0  [RESC1608X05N 0603]  (value not drawn)
R193  RNCF0603BTE10K0  [RESC1608X05N 0603]  (value not drawn)
R194  RNCF0603BTE10K0  [RESC1608X05N 0603]  (value not drawn)
U7  VOM617A-4X001T  [SOIC127P700X220-4N TLP293]
U12  AI-1027-TWT-5V-R  Value Display: 5V - 30mA  [Buzzer]

### Blocks framed on the sheet
IGNITION: C41 R86-R88 U7
BUZZER: Q32 R82 U12

### Ports
Buzz_IN (in), IGN_INT (out), TS1 (out), TS2 (out), TS3 (out), TS4 (out), TS5 (out), TS6 (out), TS7 (out), TS8 (out)

### Nets
3.3V: J13.9 J13.10 J13.11 J13.12 J13.13 J13.14 J13.15 J13.16 R88.1
5V: U12.1(+ve)
12V: J5.1
12V_SEC: J5.3
GND: C41.2 C135.1 C136.1 C137.1 C138.1 C139.1 C140.1 C141.1 C142.1 J5.4 Q32.2(Source) R82.2 R86.2 R187.1 R188.1 R189.1 R190.1 R191.1 R192.1 R193.1 R194.1 U7.1(A) U7.3(E)
BUZZ_IN: Q32.1(Gate) R82.1 ; port Buzz_IN
IGN+ve: J5.2 R87.2
IGN_INT: R88.2 U7.4(C) ; port IGN_INT
TS1: C142.2 J13.8 R194.2 ; port TS1
TS2: C141.2 J13.7 R193.2 ; port TS2
TS3: C140.2 J13.6 R192.2 ; port TS3
TS4: C139.2 J13.5 R191.2 ; port TS4
TS5: C138.2 J13.4 R190.2 ; port TS5
TS6: C137.2 J13.3 R189.2 ; port TS6
TS7: C136.2 J13.2 R188.2 ; port TS7
TS8: C135.2 J13.1 R187.2 ; port TS8
NetC41_1: C41.1 R86.1 R87.1 U7.2(C)
NetQ32_3: Q32.3(Drain) U12.2(-ve)

### Notes on the sheet
- Thermistor Connection
- Right Angled P/N
- 61201621721

### Library data of the parts
C41 = Cap_CC0603KRX7R7BB104: as C62 on sheet Power Section; Manufacturer Part Number: CC0603KRX7R7BB104; Category: Capacitor; ComponentLink1Description: Datasheet; Mount Type: Surface Mount; Package: 0603; RoHS: Yes; Supplier 1: Digikey; Supplier 1 Part Number: 311-1088-1-ND; Supplier 1 pricing per Unit: 8.34 INR; Supplier: Mouser; Supplier Part Number: 603-CC603KRX7R7BB104; Supplier pricing per Unit: 8.34 INR; Technology: Ceramic; Temp Coefficient: X7R; Tolerance: 10%; Value 1: CC0603KRX7R7BB104; Voltage: 16V; ComponentLink1URL: https://www.yageo.com/upload/media/product/productsearch/datasheet/mlcc/UPY-GPHC_X7R_6.3V-to-250V_24.pdf
C135-C137 C139-C142 = Cap_C0603C102J3GACAUTO: Multilayer Ceramic Capacitor, 1000 pF, 25V, ±5%,  C0G 0603 [1608 Metric]; Manufacturer: KEMET; Value: 1nF; Max Temp: 125 degC; Min Temp: -55 degC; Polarized: No; Temp Coefficient: C0G, NP0; Value Display: 1nF,25 V,0603; AEC-Q: 200; Manufacturer Part Number: C0603C102J3GACAUTO; Voltage: 25V; Category: Capacitor; ComponentLink1Description: Datasheet; Mount Type: Surface Mount; Package: 0603; RoHS: Yes; Supplier 1: Digikey; Supplier 1 Part Number: 399-C0603C102J3GACAUTOCT-ND; Supplier 1 pricing per Unit: 9.17 INR; Supplier: Mouser; Supplier Part Number: 80-C0603C102J3GAUTO; Supplier pricing per Unit: 8.34 INR; Technology: Ceramic; Tolerance: 5%; Value 1: C0603C102J3GACAUTO; ComponentLink1URL: https://connect.kemet.com:7667/gateway/IntelliData-ComponentDocumentation/1.0/download/datasheet/C0603C102J3GACAUTO
C138 = Cap_C0603C102J3GACAUTO: Multilayer Ceramic Capacitor, 1000 pF, 25V, ±5%,  C0G 0603 [1608 Metric]; Manufacturer: KEMET; Value: 1nF; Max Temp: 125 degC; Min Temp: -55 degC; Polarized: No; Temp Coefficient: C0G, NP0; AEC-Q: 200; Manufacturer Part Number: C0603C102J3GACAUTO; Voltage: 25V; Category: Capacitor; ComponentLink1Description: Datasheet; Mount Type: Surface Mount; Package: 0603; RoHS: Yes; Supplier 1: Digikey; Supplier 1 Part Number: 399-C0603C102J3GACAUTOCT-ND; Supplier 1 pricing per Unit: 9.17 INR; Supplier: Mouser; Supplier Part Number: 80-C0603C102J3GAUTO; Supplier pricing per Unit: 8.34 INR; Technology: Ceramic; Tolerance: 5%; Value 1: C0603C102J3GACAUTO; ComponentLink1URL: https://connect.kemet.com:7667/gateway/IntelliData-ComponentDocumentation/1.0/download/datasheet/C0603C102J3GACAUTO
J5 = Con_559350430: 2.00mm Pitch MicroClasp Wire-to-Board Header, Dual Row, Right Angle, 4 Circuits; Crimp Part Number: 561349000; Manufacturer: Molex; Manufacturer Part Number: 0559350430; Mating Part Number: 513820400; Circuits: 4; AEC-Q: NA; Rows: 1; Value: 4 Pin; Value Display: 4 Pin/RA/TH; Category: Connector; Colour: Natural; ComponentLink1Description: Datasheet; Pitch: 2.00 mm; ComponentLink1URL: https://www.molex.com/en-us/products/part-detail-pdf/559350430?display=pdf; Mount Type: TH; Package: THT; RoHS: Yes; Supplier 1: Digikey; Supplier 1 Part Number: WM12300-ND; Supplier 1 pricing per Unit: 36.05 INR; Supplier: Mouser; Supplier Part Number: 538-55935-0430; Supplier pricing per Unit: 28.36 INR; Value 1: 559350430
J13 = Con_559591630: 2.00mm Pitch MicroClasp Wire-to-Board Header, Dual Row, Right Angle, 16 Circuits; Crimp Part Number: 561349000; Manufacturer: Molex; Manufacturer Part Number: 0559591630; Mating Part Number: 513531600; AEC-Q: No; Circuits: 16; Pitch (mm): 2.00; Rows: 2; Value: 0559591630; Category: Connector; Colour: Natural; RoHS: Yes; Supplier 1: Digikey; Supplier 1 Part Number: WM7597-ND; Supplier 1 Price per Unit: 77.84; Supplier: Mouser; Supplier Part Number: 538-55959-1630; Supplier Price per Unit: 74.23
Q32 = FET_DMG2302UK-7: as Q31 on sheet Power Section; Manufacturer Part Number: DMG2302UK-7; Value: 20V 2.8A; RoHS: Yes; Category: MOSFET; ComponentLink1Description: Datasheet; ComponentLink1URL: https://www.diodes.com/assets/Datasheets/DMG2302UK.pdf; Forward Current: 2.8A; Mount Type: Surface Mount; Package: SOT 23-3; Power: 660mW; Supplier 1: Digikey; Supplier 1 Part Number: DMG2302UK-7DICT-ND; Supplier 1 pricing per Unit: 28.35 INR; Supplier: Mouser; Supplier Part Number: 621-DMG2302UK-7; Supplier pricing per Unit: 22.52 INR; Value 1: DMG2302UK-7; Voltage: 20V; Channel: N-Channel
R82 R88 = Res_CRCW060310K0FKEA: as R100 on sheet Power Section; Category: Resistor; ComponentLink1Description: Datasheet; ComponentLink1URL: https://www.vishay.com/docs/20035/dcrcwe3.pdf; Manufacturer Part Number: CRCW060310K0FKEA; Mount Type: Surface Mount; Package: 0603; RoHS: Yes; Supplier 1: Digikey; Supplier 1 Part Number: 541-10.0KHCT-ND; Supplier 1 pricing per Unit: 8.34 INR; Supplier: Mouser; Supplier Part Number: 71-CRCW0603-10K-E3; Supplier pricing per Unit: 8.34 INR; Tolerance: 1%; Value 1: CRCW060310K0FKEA
R86 = Res_CRCW0603100KFKEA: as R93 on sheet Power Section; Manufacturer Part Number: CRCW0603100KFKEA; Category: Resistor; ComponentLink1Description: Datasheet; ComponentLink1URL: https://www.vishay.com/docs/20035/dcrcwe3.pdf; Mount Type: Surface Mount; Package: 0603; RoHS: Yes; Supplier 1: Digikey; Supplier 1 Part Number: 541-100KCCT-ND; Supplier 1 pricing per Unit: 8.34 INR; Supplier: Mouser; Supplier Part Number: 71-CRCW0603-100K-E3; Supplier pricing per Unit: 8.34 INR; Tolerance: 1%; Value 1: CRCW0603100KFKEA
R87 = Res_AC0603FR-7W1KL: SMD Chip Resistor, 1k Ohms ±1% , 1/5W, 0603 (1608 Metric) Anti-Sulfur, Automotive AEC-Q200 Thick Film; Manufacturer: Yageo; AEC-Q: 200; Max Temp: 155 degC; Min Temp: -55 degC; Value: 1k R; Category: Resistor; ComponentLink1Description: Datasheet; ComponentLink1URL: https://www.yageo.com/upload/media/product/productsearch/datasheet/rchip/PYu-AC_51_RoHS_L_10.pdf; Manufacturer Part Number: AC0603FR-7W1KL; Mount Type: Surface Mount; Package: 0603; Power: 1/5 W; RoHS: Yes; Supplier 1: Digikey; Supplier 1 Part Number: 13-AC0603FR-7W1KLCT-ND; Supplier 1 pricing per Unit: 8.34 INR; Supplier: Mouser; Supplier Part Number: 603-AC0603FR-7W1KL; Supplier pricing per Unit: 8.34 INR; Tolerance: 1%; Value 1: AC0603FR-7W1KL
R187 = Res_RNCF0603BTE10K0: SMD Chip Resistor, 10 kOhm, 100 mW, 0603 [1608 Metric], Thick Film, General Purpose, High Precision; Manufacturer: Stackpole Electronics; Value: 10k R; Tolerance: 0.1%; AEC-Q: 200; Max Temp: 155 degC; Min Temp: -55 degC; Power: 1/6W; Manufacturer Part Number: RNCF0603BTE10K0; Package: 0603; Category: Resistor; ComponentLink1Description: Datasheet; ComponentLink1URL: https://www.seielect.com/catalog/sei-rncf.pdf; Mount Type: Surface Mount; RoHS: Yes; Supplier 1: Digikey; Supplier 1 Part Number: RNCF0603BTE10K0CT-ND; Supplier 1 pricing per Unit: 13.34 INR; Supplier: Mouser; Supplier Part Number: 708-RNCF0603BTE10K0; Supplier pricing per Unit: 12.51 INR; Value 1: RNCF0603BTE10K0
R188-R194 = Res_RNCF0603BTE10K0: SMD Chip Resistor, 10 kOhm, 100 mW, 0603 [1608 Metric], Thick Film, General Purpose, High Precision; Manufacturer: Stackpole Electronics; Value: 10k R; Tolerance: 0.1%; AEC-Q: 200; Max Temp: 155 degC; Min Temp: -55 degC; Power: 1/6W; Value Display: 10kE, 0.1%, 0603; Manufacturer Part Number: RNCF0603BTE10K0; Package: 0603; Category: Resistor; ComponentLink1Description: Datasheet; ComponentLink1URL: https://www.seielect.com/catalog/sei-rncf.pdf; Mount Type: Surface Mount; RoHS: Yes; Supplier 1: Digikey; Supplier 1 Part Number: RNCF0603BTE10K0CT-ND; Supplier 1 pricing per Unit: 13.34 INR; Supplier: Mouser; Supplier Part Number: 708-RNCF0603BTE10K0; Supplier pricing per Unit: 12.51 INR; Value 1: RNCF0603BTE10K0
U7 = IC_VOM617A-4X001T: Optoisolator Transistor Output 3750Vrms 1 Channel 4-SOP; Manufacturer: Vishay Dale; AEC-Q: NA; Max Temp: 110 degC; Min Temp: -55 degC; Value: 1.6V - 60mA/ 80V - 100mA; Category: Opto Coupler; ComponentLink1Description: Datasheet; ComponentLink1URL: https://www.vishay.com/docs/83446/vom617a.pdf; Manufacturer Part Number: VOM617A-4X001T; Mount Type: Surface Mount; Package: SOP 4; RoHS: Yes; Supplier 1: Digikey; Supplier 1 Part Number: VOM617A-4X001TCT-ND; Supplier 1 pricing per Unit: 52.14 INR; Supplier: Mouser; Supplier Part Number: 78-VOM617A-4X001T; Supplier pricing per Unit: 52.71 INR; Value 1: VOM617A-4X001T; Value Display: 1.6V - 60mA/ 80V - 100mA; Voltage: 3750 VRMS
U12 = IC_AI-1027-TWT-5V-R: Buzzers Indicator, Internally Driven Electromechanical/Magnetic 5 V 30mA 2.7kHz 80dB @ 5V, 10cm Through Hole PC Pins; Manufacturer: PUIaudio; AEC-Q: NA; Max Temp: 80 degC; Min Temp: -20 degC; Category: Buzzer; ComponentLink1Description: Datasheet; ComponentLink1URL: https://docs.google.com/gview?url=https://api.puiaudio.com/filename/AI-1027-TWT-5V-R.pdf&embedded=true; Manufacturer Part Number: AI-1027-TWT-5V-R; Mount Type: TH; Package: TH; RoHS: Yes; Supplier 1: Digikey; Supplier 1 Part Number: 668-1339-ND; Supplier 1 pricing per Unit: 124.45 INR; Supplier: Mouser; Supplier Part Number: 665-AI-1027TWT5VR; Supplier pricing per Unit: 123.43 INR; Value 1: AI-1027-TWT-5V-R; Value: 5V 30mA 2.7kHz; Voltage: 5V

## Sheet Pressure sensor.SchDoc
size A3; SheetNumber: 11; SheetTotal: 12
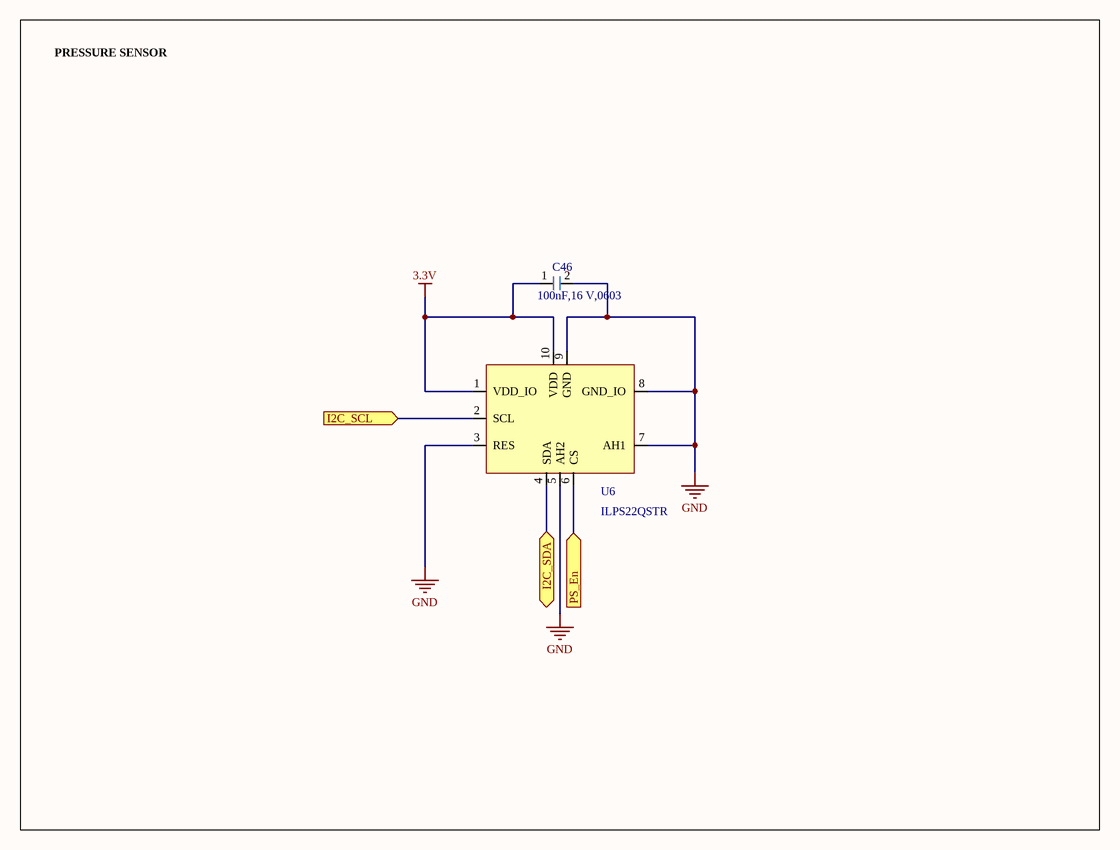
[diagram p10: Pressure sensor.SchDoc]

### Parts
C46  Value Display: 100nF,16 V,0603  [CAPC1608X05N 0603]  (hidden comment: CC0603KRX7R7BB104)
U6  ILPS22QSTR  [QFN50P200X200X80-10N]

### Blocks framed on the sheet
PRESSURE SENSOR: C46 U6

### Ports
I2C_SCL (in), I2C_SDA (bidir), PS_En (in)

### Nets
3.3V: C46.1 U6.1(VDD_IO) U6.10(VDD)
GND: C46.2 U6.3(RES) U6.5(AH2) U6.7(AH1) U6.8(GND_IO) U6.9(GND)
I2C_EN: U6.6(CS) ; port PS_En
I2C_SCL: U6.2(SCL) ; port I2C_SCL
I2C_SDA: U6.4(SDA) ; port I2C_SDA

### Library data of the parts
C46 = Cap_CC0603KRX7R7BB104: as C62 on sheet Power Section; Manufacturer Part Number: CC0603KRX7R7BB104; Category: Capacitor; ComponentLink1Description: Datasheet; Mount Type: Surface Mount; Package: 0603; RoHS: Yes; Supplier 1: Digikey; Supplier 1 Part Number: 311-1088-1-ND; Supplier 1 pricing per Unit: 8.34 INR; Supplier: Mouser; Supplier Part Number: 603-CC603KRX7R7BB104; Supplier pricing per Unit: 8.34 INR; Technology: Ceramic; Temp Coefficient: X7R; Tolerance: 10%; Value 1: CC0603KRX7R7BB104; Voltage: 16V; ComponentLink1URL: https://www.yageo.com/upload/media/product/productsearch/datasheet/mlcc/UPY-GPHC_X7R_6.3V-to-250V_24.pdf
U6 = IC_ILPS22QSTR: Pressure Sensor 3.77PSI ~ 58.89PSI (26kPa ~ 406kPa) Absolute 24 b 10-WFLGA; Manufacturer: ST; AEC-Q: NA; Max Temp: 105 degC; Min Temp: -40 degC; Value: 3.3V - 50uA; Voltage: 3.3V; Category: Pressure Sensor; ComponentLink1Description: Datasheet; ComponentLink1URL: https://www.st.com/resource/en/datasheet/ilps22qs.pdf; Manufacturer Part Number: ILPS22QSTR; Mount Type: Surface Mount; Package: HLGA; RoHS: Yes; Supplier 1: Digikey; Supplier 1 Part Number: 497-ILPS22QSTRCT-ND; Supplier 1 pricing per Unit: 377.56 INR; Supplier: Mouser; Supplier Part Number: 511-ILPS22QSTR; Supplier pricing per Unit: 395.35 INR; Value 1: ILPS22QSTR; Value Display: 3.3V - 50uA

## Sheet Memory_256M.SchDoc
size A3; SheetNumber: 7; SheetTotal: 12
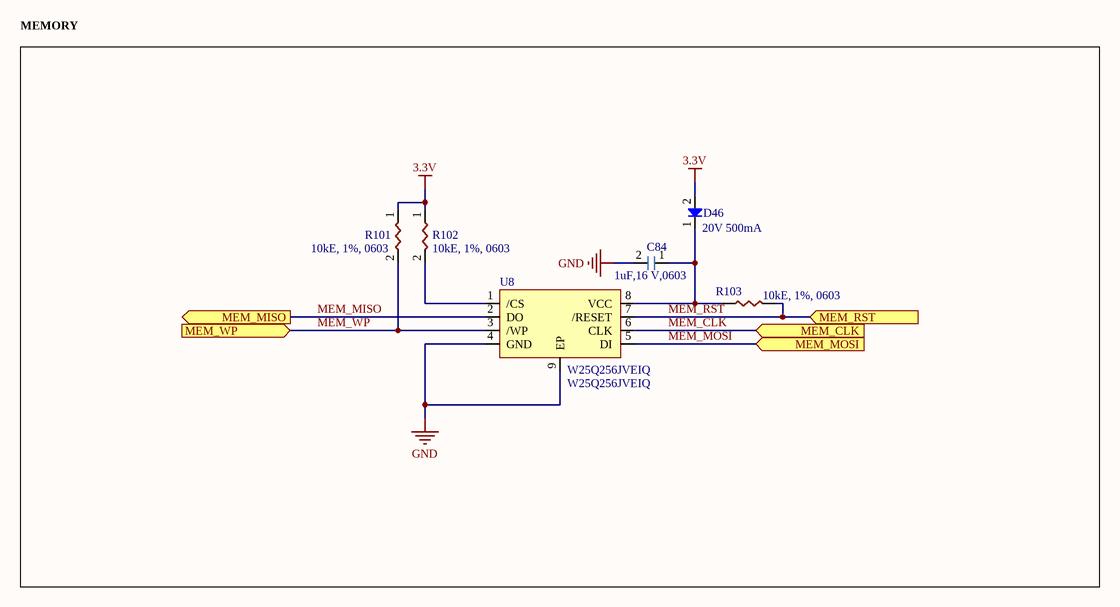
[diagram p11: Memory_256M.SchDoc]

### Parts
C84  Value Display: 1uF,16 V,0603  [CAPC1608X05N 0603]  (hidden comment: CGA3E1X7R1C105K080AC)
D46  Value Display: 20V 500mA  [DIODE_SOD123]  (hidden comment: SBR80520LT1G)
R101  Value Display: 10kE, 1%, 0603  [RESC1608X05N 0603]  (hidden comment: CRCW060310K0FKEA)
R102  Value Display: 10kE, 1%, 0603  [RESC1608X05N 0603]  (hidden comment: CRCW060310K0FKEA)
R103  Value Display: 10kE, 1%, 0603  [RESC1608X05N 0603]  (hidden comment: CRCW060310K0FKEA)
U8  W25Q256JVEIQ  [SON127P800X80_HS-9N]

### Blocks framed on the sheet
MEMORY: C84 D46 R101-R103 U8

### Ports
MEM_CLK (in), MEM_MISO (out), MEM_MOSI (in), MEM_RST (in), MEM_WP (in)

### Nets
3.3V: D46.2(Anode) R101.1 R102.1
GND: C84.2 U8.4(GND) U8.9(EP)
MEM_CLK: U8.6(CLK) ; port MEM_CLK
MEM_MISO: U8.2(DO) ; port MEM_MISO
MEM_MOSI: U8.5(DI) ; port MEM_MOSI
MEM_RST: R103.1 U8.7(/RESET) ; port MEM_RST
MEM_WP: R102.2 U8.3(/WP) ; port MEM_WP
NetC84_1: C84.1 D46.1(Cathode) R103.2 U8.8(VCC)
NetR101_2: R101.2 U8.1(/CS)

### Library data of the parts
C84 = Cap_CGA3E1X7R1C105K080AC: as C71 on sheet Power Section; Value: 1 uF; Manufacturer Part Number: CGA3E1X7R1C105K080AC; Package: 0603; RoHS: Yes; Mount Type: Surface Mount; Supplier 1: Digikey; Voltage: 16V; Tolerance: 10%; Technology: Ceramic; Value 1: CGA3E1X7R1C105K080AC; Category: Capacitor; ComponentLink1Description: Datasheet; ComponentLink1URL: https://product.tdk.com/system/files/dam/doc/product/capacitor/ceramic/mlcc/catalog/mlcc_automotive_general_en.pdf; Supplier 1 Part Number: 445-12539-1-ND; Supplier 1 pricing per Unit: 10.84 INR; Supplier: Mouser; Supplier Part Number: 810-CGA3E1X7R1C105AC; Supplier pricing per Unit: 10.01 INR; Temp Coefficient: X7R
D46 = Diode_SBR80520LT1G: as D41 on sheet Power Section; Category: Diode; ComponentLink1Description: Datasheet; ComponentLink1URL: https://www.onsemi.com/pdf/datasheet/mbr0520lt1-d.pdf; Forward Current: 500mA; Manufacturer Part Number: SBR80520LT1G; Mount Type: Surface Mount; Package: SOD 123; RoHS: Yes; Supplier 1: Digikey; Supplier 1 Part Number: SBR80520LT1GOSCT-ND; Supplier 1 pricing per Unit: 34.22 INR; Supplier: Mouser; Supplier Part Number: 863-SBR80520LT1G; Supplier pricing per Unit: 34.19 INR; Value 1: SBR80520LT1G; Value: 20V 500mA
R101-R103 = Res_CRCW060310K0FKEA: as R100 on sheet Power Section; Category: Resistor; ComponentLink1Description: Datasheet; ComponentLink1URL: https://www.vishay.com/docs/20035/dcrcwe3.pdf; Manufacturer Part Number: CRCW060310K0FKEA; Mount Type: Surface Mount; Package: 0603; RoHS: Yes; Supplier 1: Digikey; Supplier 1 Part Number: 541-10.0KHCT-ND; Supplier 1 pricing per Unit: 8.34 INR; Supplier: Mouser; Supplier Part Number: 71-CRCW0603-10K-E3; Supplier pricing per Unit: 8.34 INR; Tolerance: 1%; Value 1: CRCW060310K0FKEA
U8 = IC_W25Q256JVEIQ: FLASH - NOR Memory IC 256Mbit SPI - Quad I/O 133 MHz 8-WSON (8x6); Manufacturer: Winbond; AEC-Q: NA; Max Temp: 85 degC; Min Temp: -40 degC; Value: 4 kb 256Mbit; Voltage: 3.3V; Category: Flash Memory; ComponentLink1Description: Datasheet; ComponentLink1URL: https://www.winbond.com/hq/support/documentation/levelOne.jsp?__locale=en&DocNo=DA00-W25Q256JV; Data Flash: 256Mbit; Manufacturer Part Number: W25Q256JVEIQ; Mount Type: Surface Mount; Package: WSON-8; RoHS: Yes; Supplier 1: Digikey; Supplier 1 Part Number: W25Q256JVEIQ-ND; Supplier 1 pricing per Unit: 268.68 INR; Supplier: Mouser; Supplier Part Number: 454-W25Q256JVEIQ; Supplier pricing per Unit: 267.71 INR; Value 1: W25Q256JVEIQ; Value Display: W25Q256JVEIQ

## Nets that join several sheets
3.3V: ESP32_S3 (C30.1 R84.1 R85.1 U9.3), Isolated Communication (C52.2 C64.2 U2.1 U3.1), Power Section (C83.2 U5.2), Accelerometer (C44.2 C45.1 U11.5 U11.8), Connections1 (9 pins), Pressure sensor (C46.1 U6.1 U6.10), Memory_256M (D46.2 R101.1 R102.1)
5V: Monitoring_BQ76952 (J2.5), Isolated Communication (FB3.1 FB4.1), Power Section (C71.2 U13.2), Connections1 (U12.1)
12V: Power Section (6 pins), Connections1 (J5.1)
12V_SEC: Power Section (D47.2 D79.2), Connections1 (J5.3)
GND: Monitoring_BQ76952 (21 pins), ESP32_S3 (29 pins), Isolated Communication (12 pins), MOSFET Connections (11 pins), USB - C (8 pins), Power Section (16 pins), Accelerometer (7 pins), Connections1 (23 pins), Pressure sensor (6 pins), Memory_256M (C84.2 U8.4 U8.9)
VBAT: Monitoring_BQ76952 (C22.2 D14.2 D17.2), MOSFET Connections (65 pins), Power Section (D39.2)
VBUS: USB - C (5 pins), Power Section (D78.2 D81.2)
ACC_INT2: ESP32_S3 (U9.27), Accelerometer (U11.9)
BUZZ_IN: ESP32_S3 (U9.22), Connections1 (Q32.1 R82.1)
CAN_EN: ESP32_S3 (U9.21), Isolated Communication (U3.8)
CAN_RX: ESP32_S3 (U9.18), Isolated Communication (U3.5)
CAN_STBY: ESP32_S3 (U9.20), Isolated Communication (U3.4)
CAN_TX: ESP32_S3 (U9.19), Isolated Communication (U3.3)
CHG_AFE: Monitoring_BQ76952 (U1.45), MOSFET Connections (FB1.1)
DSG_AFE: Monitoring_BQ76952 (U1.43), MOSFET Connections (FB2.1)
I2C_EN: ESP32_S3 (U9.34), Accelerometer (U11.12), Pressure sensor (U6.6)
I2C_SCL: Monitoring_BQ76952 (J2.7), ESP32_S3 (R85.2 U9.26), Accelerometer (U11.13), Pressure sensor (U6.2)
I2C_SDA: Monitoring_BQ76952 (J2.6), ESP32_S3 (R84.2 U9.25), Accelerometer (U11.14), Pressure sensor (U6.4)
IGN_INT: ESP32_S3 (U9.41), Connections1 (R88.2 U7.4)
LD_AFE: Monitoring_BQ76952 (U1.41), MOSFET Connections (D10.1 R23.2)
MEM_CLK: ESP32_S3 (U9.29), Memory_256M (U8.6)
MEM_MISO: ESP32_S3 (U9.31), Memory_256M (U8.2)
MEM_MOSI: ESP32_S3 (U9.30), Memory_256M (U8.5)
MEM_RST: ESP32_S3 (U9.32), Memory_256M (R103.1 U8.7)
MEM_WP: ESP32_S3 (U9.33), Memory_256M (R102.2 U8.3)
NetU1_25: Monitoring_BQ76952 (U1.25), ESP32_S3 (U9.44)
PACK_AFE: Monitoring_BQ76952 (U1.42), MOSFET Connections (D11.1 R21.2)
PCHG_AFE: Monitoring_BQ76952 (U1.40), MOSFET Connections (R15.1)
PDSG_AFE: Monitoring_BQ76952 (U1.39), MOSFET Connections (R16.1)
Power_En_AFE: Monitoring_BQ76952 (U1.32), Power Section (D41.2)
Power_En_MCU: ESP32_S3 (U9.35), Power Section (D42.2)
RS485_DE: ESP32_S3 (U9.37), Isolated Communication (U2.3)
RS485_EN: ESP32_S3 (U9.36), Isolated Communication (U2.8)
RS485_RE: ESP32_S3 (U9.38), Isolated Communication (U2.5)
RS485_RX: ESP32_S3 (U9.40), Isolated Communication (U2.4)
RS485_TX: ESP32_S3 (U9.39), Isolated Communication (U2.2)
RST_SHUT_MCU: Monitoring_BQ76952 (Q21.1 R56.1), ESP32_S3 (U9.28)
SPI_CLK: Monitoring_BQ76952 (J1.4 U1.26), ESP32_S3 (U9.16)
SPI_CS: Monitoring_BQ76952 (J1.1 U1.29), ESP32_S3 (U9.14)
SPI_MISO: Monitoring_BQ76952 (J1.3 U1.27), ESP32_S3 (U9.17)
SPI_MOSI: Monitoring_BQ76952 (J1.2 U1.28), ESP32_S3 (U9.15)
SR_N: Monitoring_BQ76952 (U1.20), MOSFET Connections (C8.2 C9.1 R19.1)
SR_P: Monitoring_BQ76952 (U1.18), MOSFET Connections (C7.2 C8.1 R18.1)
TS1: ESP32_S3 (U9.5), Connections1 (C142.2 J13.8 R194.2)
TS2: ESP32_S3 (U9.6), Connections1 (C141.2 J13.7 R193.2)
TS3: ESP32_S3 (U9.8), Connections1 (C140.2 J13.6 R192.2)
TS4: ESP32_S3 (U9.9), Connections1 (C139.2 J13.5 R191.2)
TS5: ESP32_S3 (U9.10), Connections1 (C138.2 J13.4 R190.2)
TS6: ESP32_S3 (U9.11), Connections1 (C137.2 J13.3 R189.2)
TS7: ESP32_S3 (U9.12), Connections1 (C136.2 J13.2 R188.2)
TS8: ESP32_S3 (U9.13), Connections1 (C135.2 J13.1 R187.2)
USB_D_N: ESP32_S3 (U9.23), USB - C (D48.3)
USB_D_P: ESP32_S3 (U9.24), USB - C (D48.1)